# EAGLE design thermistory_array_v2 (EAGLE 7.6.0)
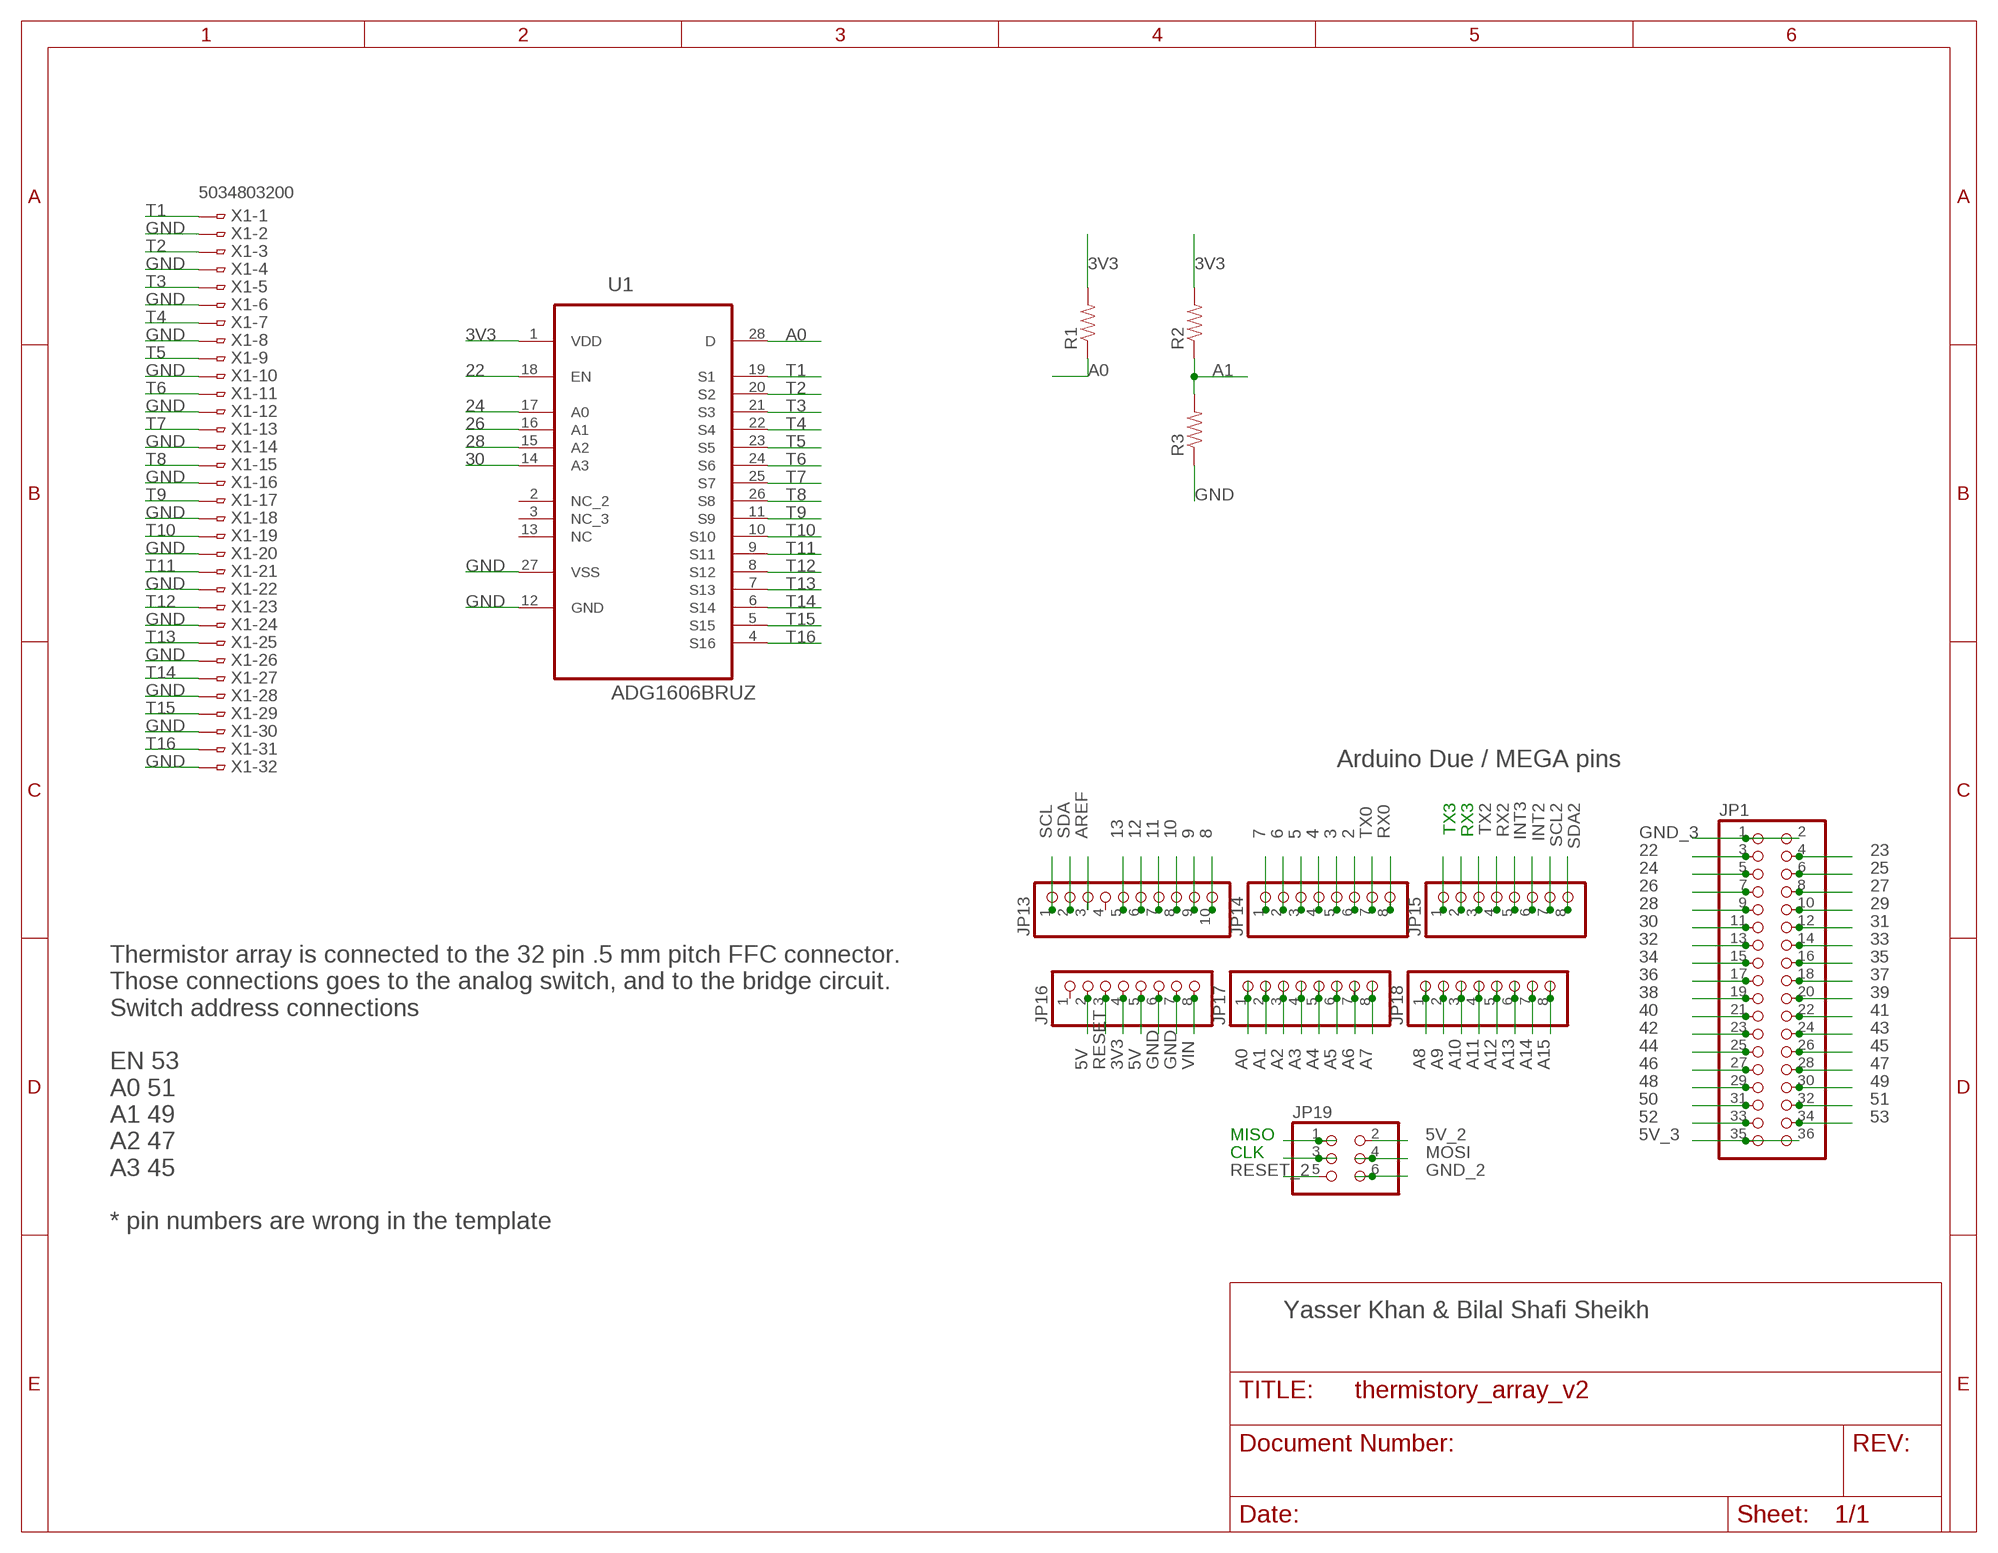
[diagram p0: schematic, sheet 1]

## Parts
JP1  PINHD-2X18  [2X18]
JP13  PINHD-1X10  [1X10]
JP14  PINHD-1X8  [1X08]
JP15  PINHD-1X8  [1X08]
JP16  PINHD-1X8  [1X08]
JP17  PINHD-1X8  [1X08]
JP18  PINHD-1X8  [1X08]
JP19  PINHD-2X3  [2X03]
R1  RESISTORKIT  [AXIAL-0.3-KIT]
R2  RESISTORKIT  [AXIAL-0.3-KIT]
R3  RESISTORKIT  [AXIAL-0.3-KIT]
U1  ADG1606BRUZ  [SOP65P640X120-28N]
X1  5034803200  [5034803200]

## Nets
2: JP14.6
3: JP14.5
3V3: JP16.4 R1.P$2 R2.P$2 U1.1(VDD)
4: JP14.4
5: JP14.3
5V: JP16.2 JP16.5
5V_2: JP19.2
5V_3: JP1.35 JP1.36
6: JP14.2
7: JP14.1
8: JP13.10
9: JP13.9
10: JP13.8
11: JP13.7
12: JP13.6
13: JP13.5
22: JP1.3 U1.18(EN)
23: JP1.4
24: JP1.5 U1.17(A0)
25: JP1.6
26: JP1.7 U1.16(A1)
27: JP1.8
28: JP1.9 U1.15(A2)
29: JP1.10
30: JP1.11 U1.14(A3)
31: JP1.12
32: JP1.13
33: JP1.14
34: JP1.15
35: JP1.16
36: JP1.17
37: JP1.18
38: JP1.19
39: JP1.20
40: JP1.21
41: JP1.22
42: JP1.23
43: JP1.24
44: JP1.25
45: JP1.26
46: JP1.27
47: JP1.28
48: JP1.29
49: JP1.30
50: JP1.31
51: JP1.32
52: JP1.33
53: JP1.34
A0: JP17.1 R1.P$1 U1.28(D)
A1: JP17.2 R2.P$1 R3.P$2
A2: JP17.3
A3: JP17.4
A4: JP17.5
A5: JP17.6
A6: JP17.7
A7: JP17.8
A8: JP18.1
A9: JP18.2
A10: JP18.3
A11: JP18.4
A12: JP18.5
A13: JP18.6
A14: JP18.7
A15: JP18.8
AREF: JP13.3
CLK: JP19.3
GND: JP16.6 JP16.7 R3.P$1 U1.12(GND) U1.27(VSS) X1.2 X1.4 X1.6 X1.8 X1.10 X1.12 X1.14 X1.16 X1.18 X1.20 X1.22 X1.24 X1.26 X1.28 X1.30 X1.32
GND_2: JP19.6
GND_3: JP1.1 JP1.2
INT2: JP15.6
INT3: JP15.5
MISO: JP19.1
MOSI: JP19.4
RESET: JP16.3
RESET_2: JP19.5
RX0: JP14.8
RX2: JP15.4
RX3: JP15.2
SCL: JP13.1
SCL2: JP15.7
SDA: JP13.2
SDA2: JP15.8
T1: U1.19(S1) X1.1
T2: U1.20(S2) X1.3
T3: U1.21(S3) X1.5
T4: U1.22(S4) X1.7
T5: U1.23(S5) X1.9
T6: U1.24(S6) X1.11
T7: U1.25(S7) X1.13
T8: U1.26(S8) X1.15
T9: U1.11(S9) X1.17
T10: U1.10(S10) X1.19
T11: U1.9(S11) X1.21
T12: U1.8(S12) X1.23
T13: U1.7(S13) X1.25
T14: U1.6(S14) X1.27
T15: U1.5(S15) X1.29
T16: U1.4(S16) X1.31
TX0: JP14.7
TX2: JP15.3
TX3: JP15.1
VIN: JP16.8
Unconnected: JP13.4 JP16.1 U1.2(NC_2) U1.3(NC_3) U1.13(NC)

## Notes on the sheet
- Arduino Due / MEGA pins
- Thermistor array is connected to the 32 pin .5 mm pitch FFC connector. 
  Those connections goes to the analog switch, and to the bridge circuit. 
  Switch address connections
  
  EN 53
  A0 51
  A1 49
  A2 47
  A3 45
  
  * pin numbers are wrong in the template
- Yasser Khan & Bilal Shafi Sheikh

## Library data of the parts
JP1 = pinhead:PINHD-2X18: PIN HEADER
JP13 = pinhead:PINHD-1X10: PIN HEADER
JP14-JP18 = pinhead:PINHD-1X8: PIN HEADER
JP19 = pinhead:PINHD-2X3: PIN HEADER
R1-R3 = SparkFun-Passives:RESISTOR: Resistor Basic schematic elements and footprints for 0603, 1206, and PTH resistors.
U1 = Analog Devices_By_element14_Batch_1:ADG1606BRUZ: 4.5 Ù RON, 16-Channel, Differential 8-Channel, ±5 V,+12 V,+5 V, and +3.3 V Multiplexers; MPN: ADG1606BRUZ; OC_FARNELL: 1827328; OC_NEWARK: 52R8046; PACKAGE: TSSOP-28; SUPPLIER: Analog Devices
X1 = con-hirose:5034803200: 0.5mm Pitch Connectors For FPC/FFC Source: Data sheet <http://www.hirose.co.jp/cataloge_hp/e58605370.pdf>

## Net classes
1 vcc: width 0.305 mm

## Board
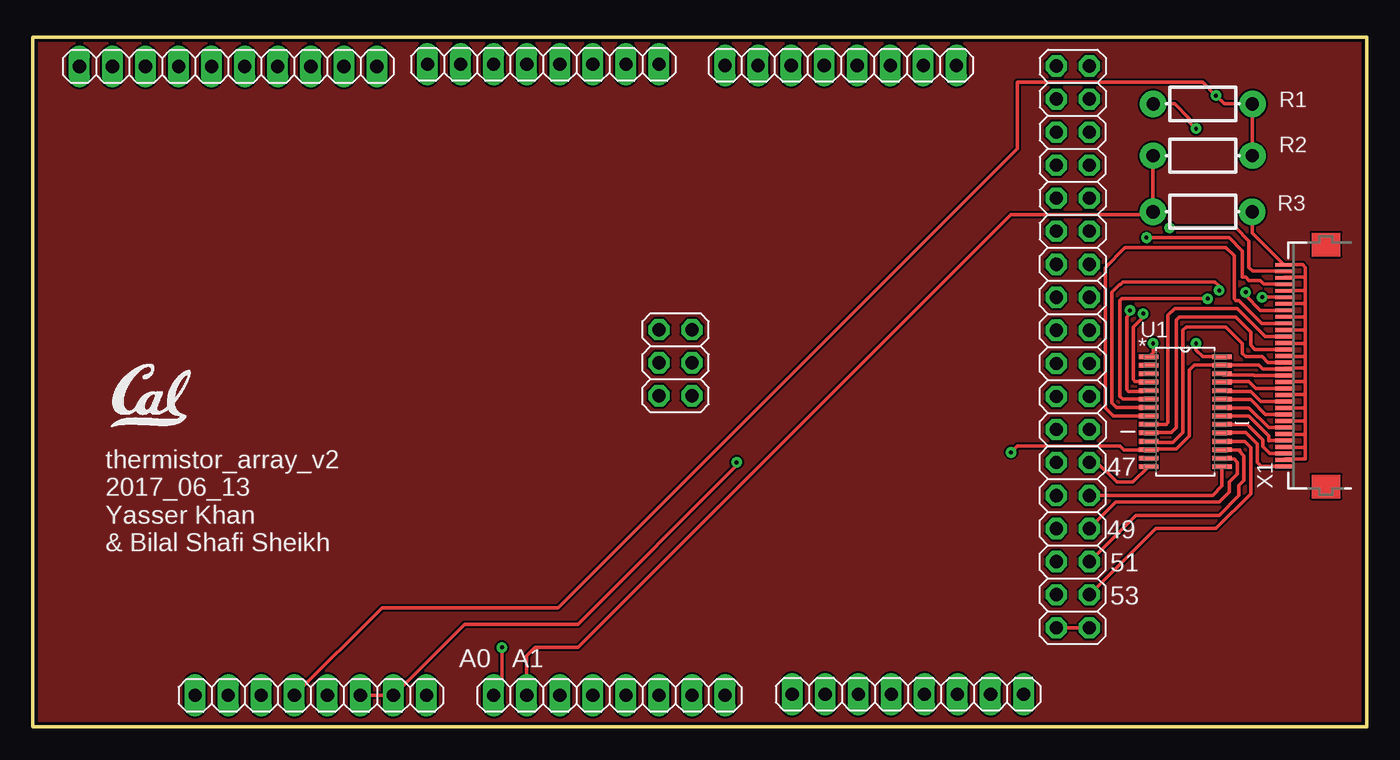
[diagram p1: board, top side]
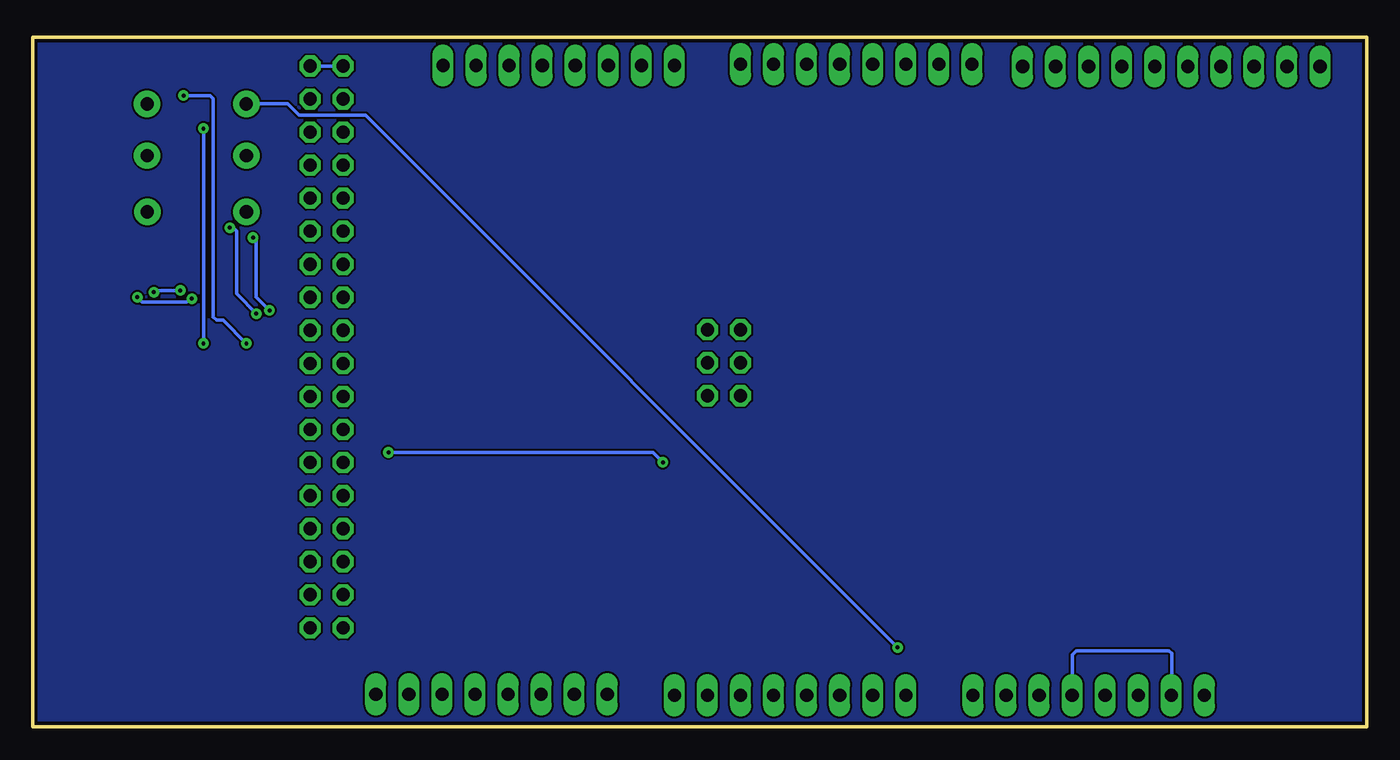
[diagram p2: board, bottom side, seen from below]

Size 102.54 x 53 mm. Coordinates in mm from the lower left corner, seen from the top.
Outline: 0,0 102.54,0 102.54,53 0,53 0,0
Copper layers (1*16): Top 0.035mm / dielectric 1.5mm / Bottom 0.035mm
Design rules "2016_09_11_SparkFun_bayareacircuits": minimum track width 8mil, minimum drill 10mil, track to track 6mil, track to pad 6mil, pad to pad 6mil, via to via 6mil, smd to smd 6mil, copper to edge 10mil, drill to drill 8mil, minimum pad ring 12mil, minimum via ring 10mil, stop-mask expansion 4mil, vias tented up to drill 25mil, thermal gap 10mil

### Footprints (pad centres in the part's own frame; a part is rotated, then mirrored left to right if it is on the bottom)
2X18 = drill 1.016 octagon: 1 -21.59,-1.27; 2 -21.59,1.27; 3 -19.05,-1.27; 4 -19.05,1.27; 5 -16.51,-1.27; 6 -16.51,1.27; 7 -13.97,-1.27; 8 -13.97,1.27; 9 -11.43,-1.27; 10 -11.43,1.27; 11 -8.89,-1.27; 12 -8.89,1.27; 13 -6.35,-1.27; 14 -6.35,1.27; 15 -3.81,-1.27; 16 -3.81,1.27; 17 -1.27,-1.27; 18 -1.27,1.27; 19 1.27,-1.27; 20 1.27,1.27; 21 3.81,-1.27; 22 3.81,1.27; 23 6.35,-1.27; 24 6.35,1.27; 25 8.89,-1.27; 26 8.89,1.27; 27 11.43,-1.27; 28 11.43,1.27; 29 13.97,-1.27; 30 13.97,1.27; 31 16.51,-1.27; 32 16.51,1.27; 33 19.05,-1.27; 34 19.05,1.27; 35 21.59,-1.27; 36 21.59,1.27
1X10 = drill 1.016 long: 1 -11.43,0; 2 -8.89,0; 3 -6.35,0; 4 -3.81,0; 5 -1.27,0; 6 1.27,0; 7 3.81,0; 8 6.35,0; 9 8.89,0; 10 11.43,0
1X08 = drill 1.016 long: 1 -8.89,0; 2 -6.35,0; 3 -3.81,0; 4 -1.27,0; 5 1.27,0; 6 3.81,0; 7 6.35,0; 8 8.89,0
2X03 = drill 1.016 octagon: 1 -2.54,-1.27; 2 -2.54,1.27; 3 0,-1.27; 4 0,1.27; 5 2.54,-1.27; 6 2.54,1.27
AXIAL-0.3-KIT = drill 1.016 pad 2.032: P$1 -3.81,0; P$2 3.81,0
SOP65P640X120-28N = smd 1.473 x 0.356: 1 -2.819,4.216; 2 -2.819,3.581; 3 -2.819,2.921; 4 -2.819,2.286; 5 -2.819,1.626; 6 -2.819,0.965; 7 -2.819,0.33; 8 -2.819,-0.33; 9 -2.819,-0.965; 10 -2.819,-1.626; 11 -2.819,-2.286; 12 -2.819,-2.921; 13 -2.819,-3.581; 14 -2.819,-4.216; 15 2.819,-4.216; 16 2.819,-3.581; 17 2.819,-2.921; 18 2.819,-2.286; 19 2.819,-1.626; 20 2.819,-0.965; 21 2.819,-0.33; 22 2.819,0.33; 23 2.819,0.965; 24 2.819,1.626; 25 2.819,2.286; 26 2.819,2.921; 27 2.819,3.581; 28 2.819,4.216
5034803200 = smd 0.3 x 1.3: 1 -7.75,3.25; 2 -7.25,3.25; 3 -6.75,3.25; 4 -6.25,3.25; 5 -5.75,3.25; 6 -5.25,3.25; 7 -4.75,3.25; 8 -4.25,3.25; 9 -3.75,3.25; 10 -3.25,3.25; 11 -2.75,3.25; 12 -2.25,3.25; 13 -1.75,3.25; 14 -1.25,3.25; 15 -0.75,3.25; 16 -0.25,3.25; 17 0.25,3.25; 18 0.75,3.25; 19 1.25,3.25; 20 1.75,3.25; 21 2.25,3.25; 22 2.75,3.25; 23 3.25,3.25; 24 3.75,3.25; 25 4.25,3.25; 26 4.75,3.25; 27 5.25,3.25; 28 5.75,3.25; 29 6.25,3.25; 30 6.75,3.25; 31 7.25,3.25; 32 7.75,3.25

### Placement (x,y rotation side)
JP1  79.93,29.19 90 top
JP13  15.03,50.75 0 top
JP14  39.25,50.92 0 top
JP15  62.1,50.83 0 top
JP16  21.38,2.41 0 top
JP17  44.33,2.41 0 top
JP18  67.27,2.49 0 top
JP19  49.41,27.98 90 top
R1  89.93,47.87 0 top
R2  89.92,43.89 0 top
R3  89.91,39.58 180 top
U1  88.58,24.21 0 top
X1  99.39,27.75 90 top

### Tracks (layer width: path | path; a pad name or v marks a point on that pad's centre or on a via)
3V3  (via drill 0.3)
  Top 0.254: U1.1 86.11,28.77 v86.11,29.46 | R2.P$2 R1.P$2 91.58,47.87 v90.93,48.51 89.92,49.53 75.69,49.53 75.69,44.45 40.39,9.14 26.85,9.14 JP16.4
  Bottom 0.254: v86.11,29.46 87.88,31.24 88.39,31.24 88.65,31.5 88.65,48.26 88.9,48.51 v90.93,48.51
5V
  Bottom 0.254: JP16.2 15.01,2.43 15.01,5.64 15.21,5.84 22.33,5.84 22.65,5.51 JP16.5
5V_3
  Bottom 0.254: JP1.36 JP1.35
22
  Top 0.254: JP1.3 86.3,15.24 90.93,15.24 93.6,17.91 93.6,21.46 93.14,21.92 U1.18
24
  Top 0.254: JP1.5 84.78,16.26 91.19,16.26 92.71,17.78 92.71,18.54 93.09,18.92 93.09,20.83 92.76,21.16 92.76,21.29 U1.17
26
  Top 0.254: JP1.7 83.25,17.27 91.19,17.27 91.95,18.03 91.95,18.8 92.58,19.43 92.58,20.32 92.33,20.57 91.95,20.57 91.89,20.63 U1.16
28
  Top 0.254: JP1.9 81.22,17.78 90.68,17.78 91.4,18.5 U1.15
30
  Top 0.254: U1.14 84.56,18.8 83.31,18.8 81.8,20.3 JP1.11
A0  (via drill 0.3)
  Top 0.254: R1.P$1 87.77,47.87 88.9,46.74 88.9,46.48 v89.41,45.97 | U1.28 91.38,28.45 89.92,28.45 89.41,28.96 v89.41,29.46 | JP17.1 36.07,3.04 v36.07,6.1
  Bottom 0.254: v89.41,29.46 v89.41,45.97 | v36.07,6.1 76.96,46.99 82.04,46.99 82.92,47.87 R1.P$1
A1
  Top 0.254: R2.P$1 R3.P$2 85.89,39.37 75.18,39.37 41.91,6.1 38.61,6.1 37.98,5.46 JP17.2
GND  (via drill 0.3)
  Top 0.254: X1.2 96.21,20.57 97.79,20.57 97.79,21.46 | 97.79,21.46 97.79,22.48 | 97.79,22.48 97.79,23.5 | 97.79,23.5 97.79,24.51 | 97.79,24.51 97.79,25.53 | 97.79,25.53 97.79,26.54 | 97.79,26.54 97.79,27.56 | 97.79,27.56 97.79,28.45 | 97.79,28.45 97.79,29.46 | 97.79,29.46 97.79,30.48 | 97.79,30.48 97.79,31.5 | 97.79,31.5 97.79,32.51 | 97.79,32.51 97.79,33.53 | 97.79,33.53 97.79,34.54 | 97.79,34.54 97.79,35.31 97.59,35.5 X1.32 93.72,37.92 R3.P$1 | X1.30 96.18,34.54 97.79,34.54 | X1.28 96.17,33.53 97.79,33.53 | X1.26 96.15,32.51 97.79,32.51 | X1.24 97.79,31.5 | X1.22 96.17,30.48 97.79,30.48 | X1.20 96.18,29.46 97.79,29.46 | X1.18 96.2,28.45 97.79,28.45 | 97.79,27.56 96.2,27.56 X1.16 94.54,27.5 94.23,27.81 91.42,27.81 U1.27 89.26,27.79 88.9,27.43 88.9,22.35 87.88,21.34 85.81,21.34 U1.12 83.87,21.29 83.57,21.59 75.69,21.59 v75.18,21.08 | X1.14 96.18,26.54 97.79,26.54 | X1.12 96.17,25.53 97.79,25.53 | X1.10 97.79,24.51 | X1.8 96.15,23.5 97.79,23.5 | X1.6 96.17,22.48 97.79,22.48 | X1.4 96.18,21.46 97.79,21.46 | JP16.6 JP16.7 33.2,7.87 41.91,7.87 54.1,20.07 v54.1,20.32
  Bottom 0.254: v54.1,20.32 54.86,21.08 v75.18,21.08
GND_3
  Top 0.254: JP1.2 JP1.1
N$1
  pour Bottom: 0,53.09 102.62,53.09 102.62,0 0,0
N$2
  pour Top: 0,53.09 102.62,53.09 102.62,0 0.25,0 0,0
T1
  Top 0.254: U1.19 91.42,22.61 93.22,22.61 94.11,21.72 94.11,20.32 94.42,20 X1.1
T2
  Top 0.254: U1.20 93.34,23.24 94.54,22.05 94.54,21.54 95.07,21 X1.3
T3
  Top 0.254: U1.21 93.47,23.88 95,22.35 95,21.97 95.03,22 X1.5
T4
  Top 0.254: U1.22 91.43,24.51 93.47,24.51 94.98,23 X1.7
T5
  Top 0.254: U1.23 91.43,25.15 93.6,25.15 94.74,24 X1.9
T6
  Top 0.254: U1.24 91.45,25.78 93.6,25.78 94.38,25 X1.11
T7
  Top 0.254: U1.25 91.45,26.54 93.47,26.54 94.01,26 X1.13
T8
  Top 0.254: U1.26 91.48,27.05 93.85,27.05 93.9,27 X1.15
T9
  Top 0.254: U1.11 85.84,21.84 87.63,21.84 88.39,22.61 88.39,30.48 88.65,30.73 91.69,30.73 92.96,29.46 92.96,28.7 93.22,28.45 94.49,28.45 94.93,28 X1.17
T10
  Top 0.254: U1.10 85.78,22.61 87.5,22.61 87.88,22.99 87.88,31.24 88.14,31.5 92.46,31.5 93.6,30.35 93.6,29.34 93.93,29 X1.19
T11
  Top 0.254: U1.9 87.12,23.24 87.25,23.37 87.25,31.62 87.76,32.13 92.58,32.13 94.71,30 X1.21
T12
  Top 0.254: U1.8 83.06,23.88 82.42,24.51 82.42,35.31 83.95,36.83 91.69,36.83 92.33,36.2 92.33,32.89 92.46,32.77 92.71,32.77 94.47,31 X1.23
T13  (via drill 0.3)
  Top 0.254: X1.25 94.36,32 93.22,33.15 v93.22,33.4 | U1.7 83.28,24.54 82.93,24.89 82.93,33.4 83.52,33.98 83.59,33.98 83.8,34.19 90.86,34.19 91.19,33.86 v91.19,33.53
  Bottom 0.254: v93.22,33.4 93.09,33.53 v91.19,33.53
T14  (via drill 0.3)
  Top 0.254: X1.27 96.13,33.02 v94.49,33.02 | v90.3,32.89 83.69,32.89 83.57,32.77 83.57,25.4 83.79,25.18 U1.6
  Bottom 0.254: v94.49,33.02 94.11,32.64 90.68,32.64 90.42,32.89 v90.3,32.89
T15  (via drill 0.3)
  Top 0.254: U1.5 85.71,25.78 84.2,25.78 84.07,25.91 84.07,31.5 84.33,31.75 v84.33,32 84.2,31.88 | v85.6,37.59 91.95,37.59 92.96,36.58 92.96,34.54 93.22,34.54 93.47,34.29 94.36,34.29 94.62,34.04 96.11,34.04 X1.29
  Bottom 0.254: v84.33,32 85.34,33.02 85.34,37.34 v85.6,37.59
T16  (via drill 0.3)
  Top 0.254: U1.4 85.71,26.54 84.71,26.54 84.58,26.67 84.58,30.73 85.34,31.5 v85.34,31.75 | v87.38,38.35 92.46,38.35 93.47,37.34 93.47,35.31 93.77,35 X1.31
  Bottom 0.254: v85.34,31.75 86.87,33.27 86.87,38.1 87.12,38.35 v87.38,38.35

### Text on the board
tPlace: C:/Users/tasif/Dropbox/github/wearX/hardware/libraries/cal.bmp | 47 | 49 | thermistor_array_v2 / 2017_06_13 / Yasser Khan / & Bilal Shafi Sheikh | 51 | 53 | A0 | A1